# EasyEDA Pro project ProPrj_智能视觉集成板-V3.0.epro, schematic Schematic5
Board Name: Board1; Create Date: 2025-04-23; Page Name: P1; Project Name: 009-智能视觉集成板-V2.0; Schematic Name: Schematic5; Update Date: 2025-04-23; Company: 嘉立创EDA; Page Size: A4; Version: V1.0
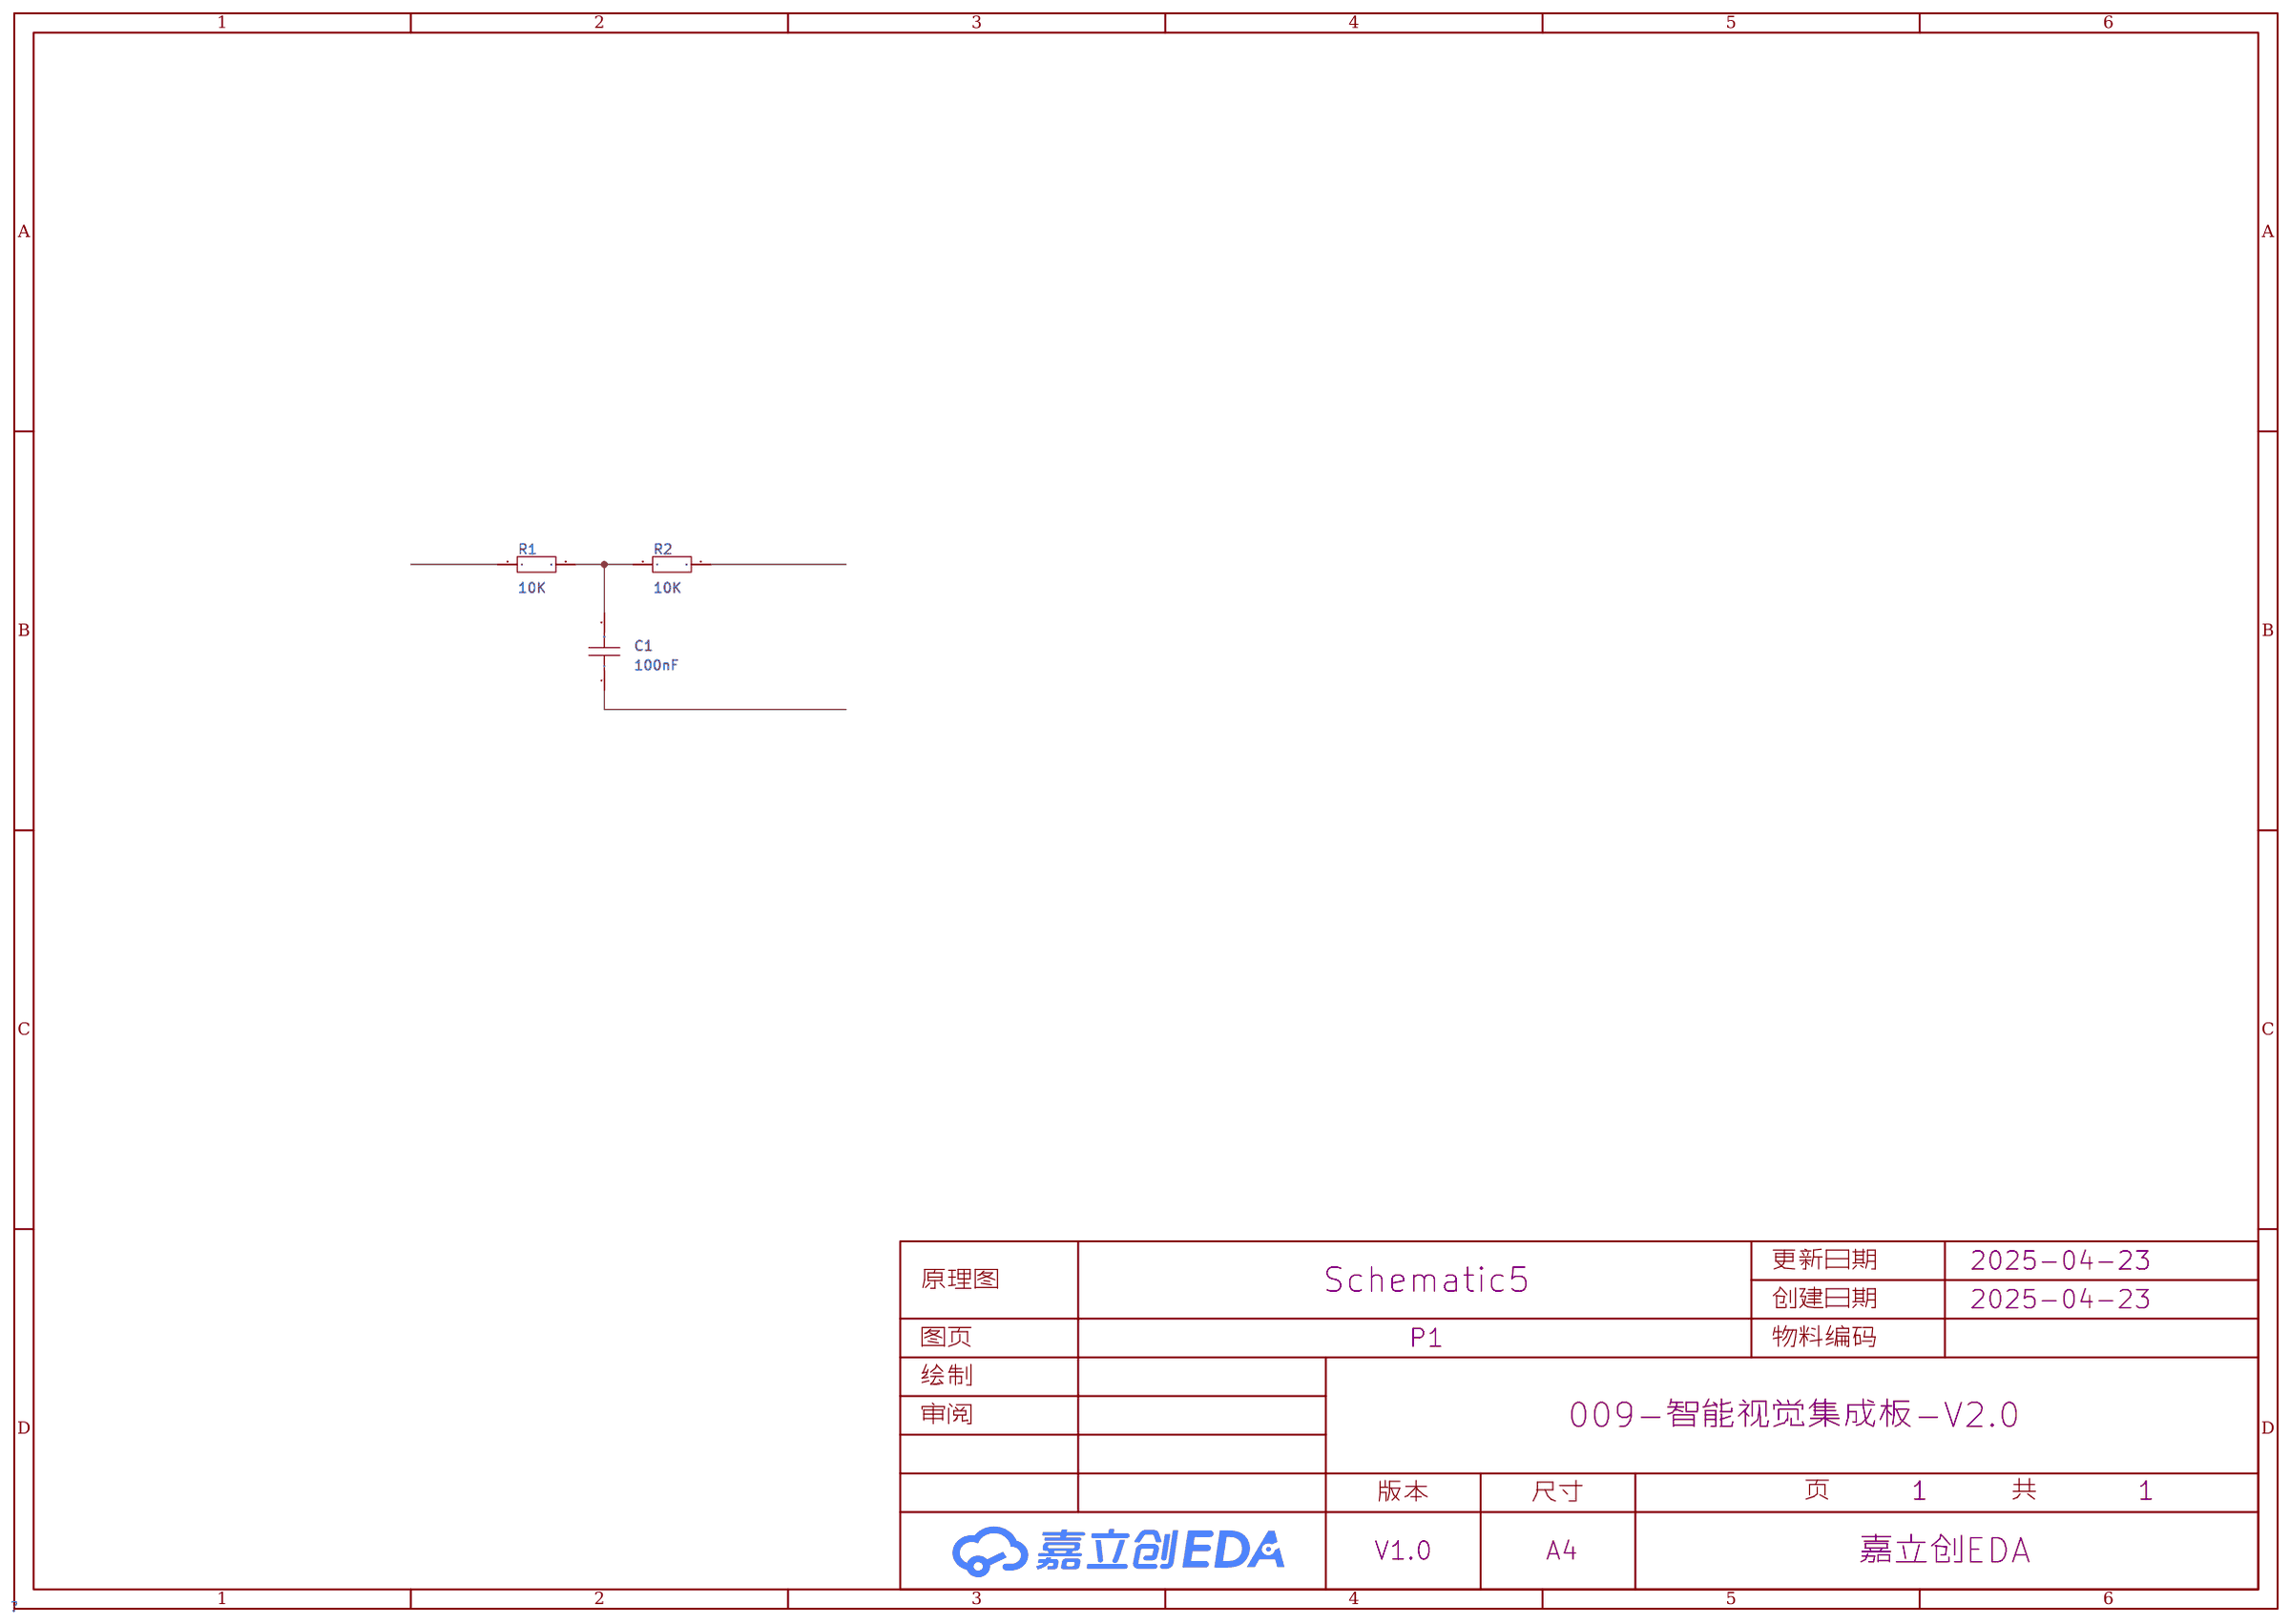
[diagram p13: schematic sheet]

## Parts
C1  100nF  [C0603]
R1  10K  [R0603]
R2  10K  [R0603]

## Library data of the parts
C1 = CAP_0603: Supplier Footprint: 0603
R1 R2 = Res_0603: Supplier Footprint: 0603

## Nets
$1N185: C1.2 R1.2 R2.1

Not connected (* = marked no-connect by the designer): C1 1; R1 1; R2 2
